# Altium schematic sheet Pixel1.0_1.SchDoc: Pixel1.0
size 409 x 282 mm; Date: 5/11/2016 6:59:08 PM; SheetNumber: 2
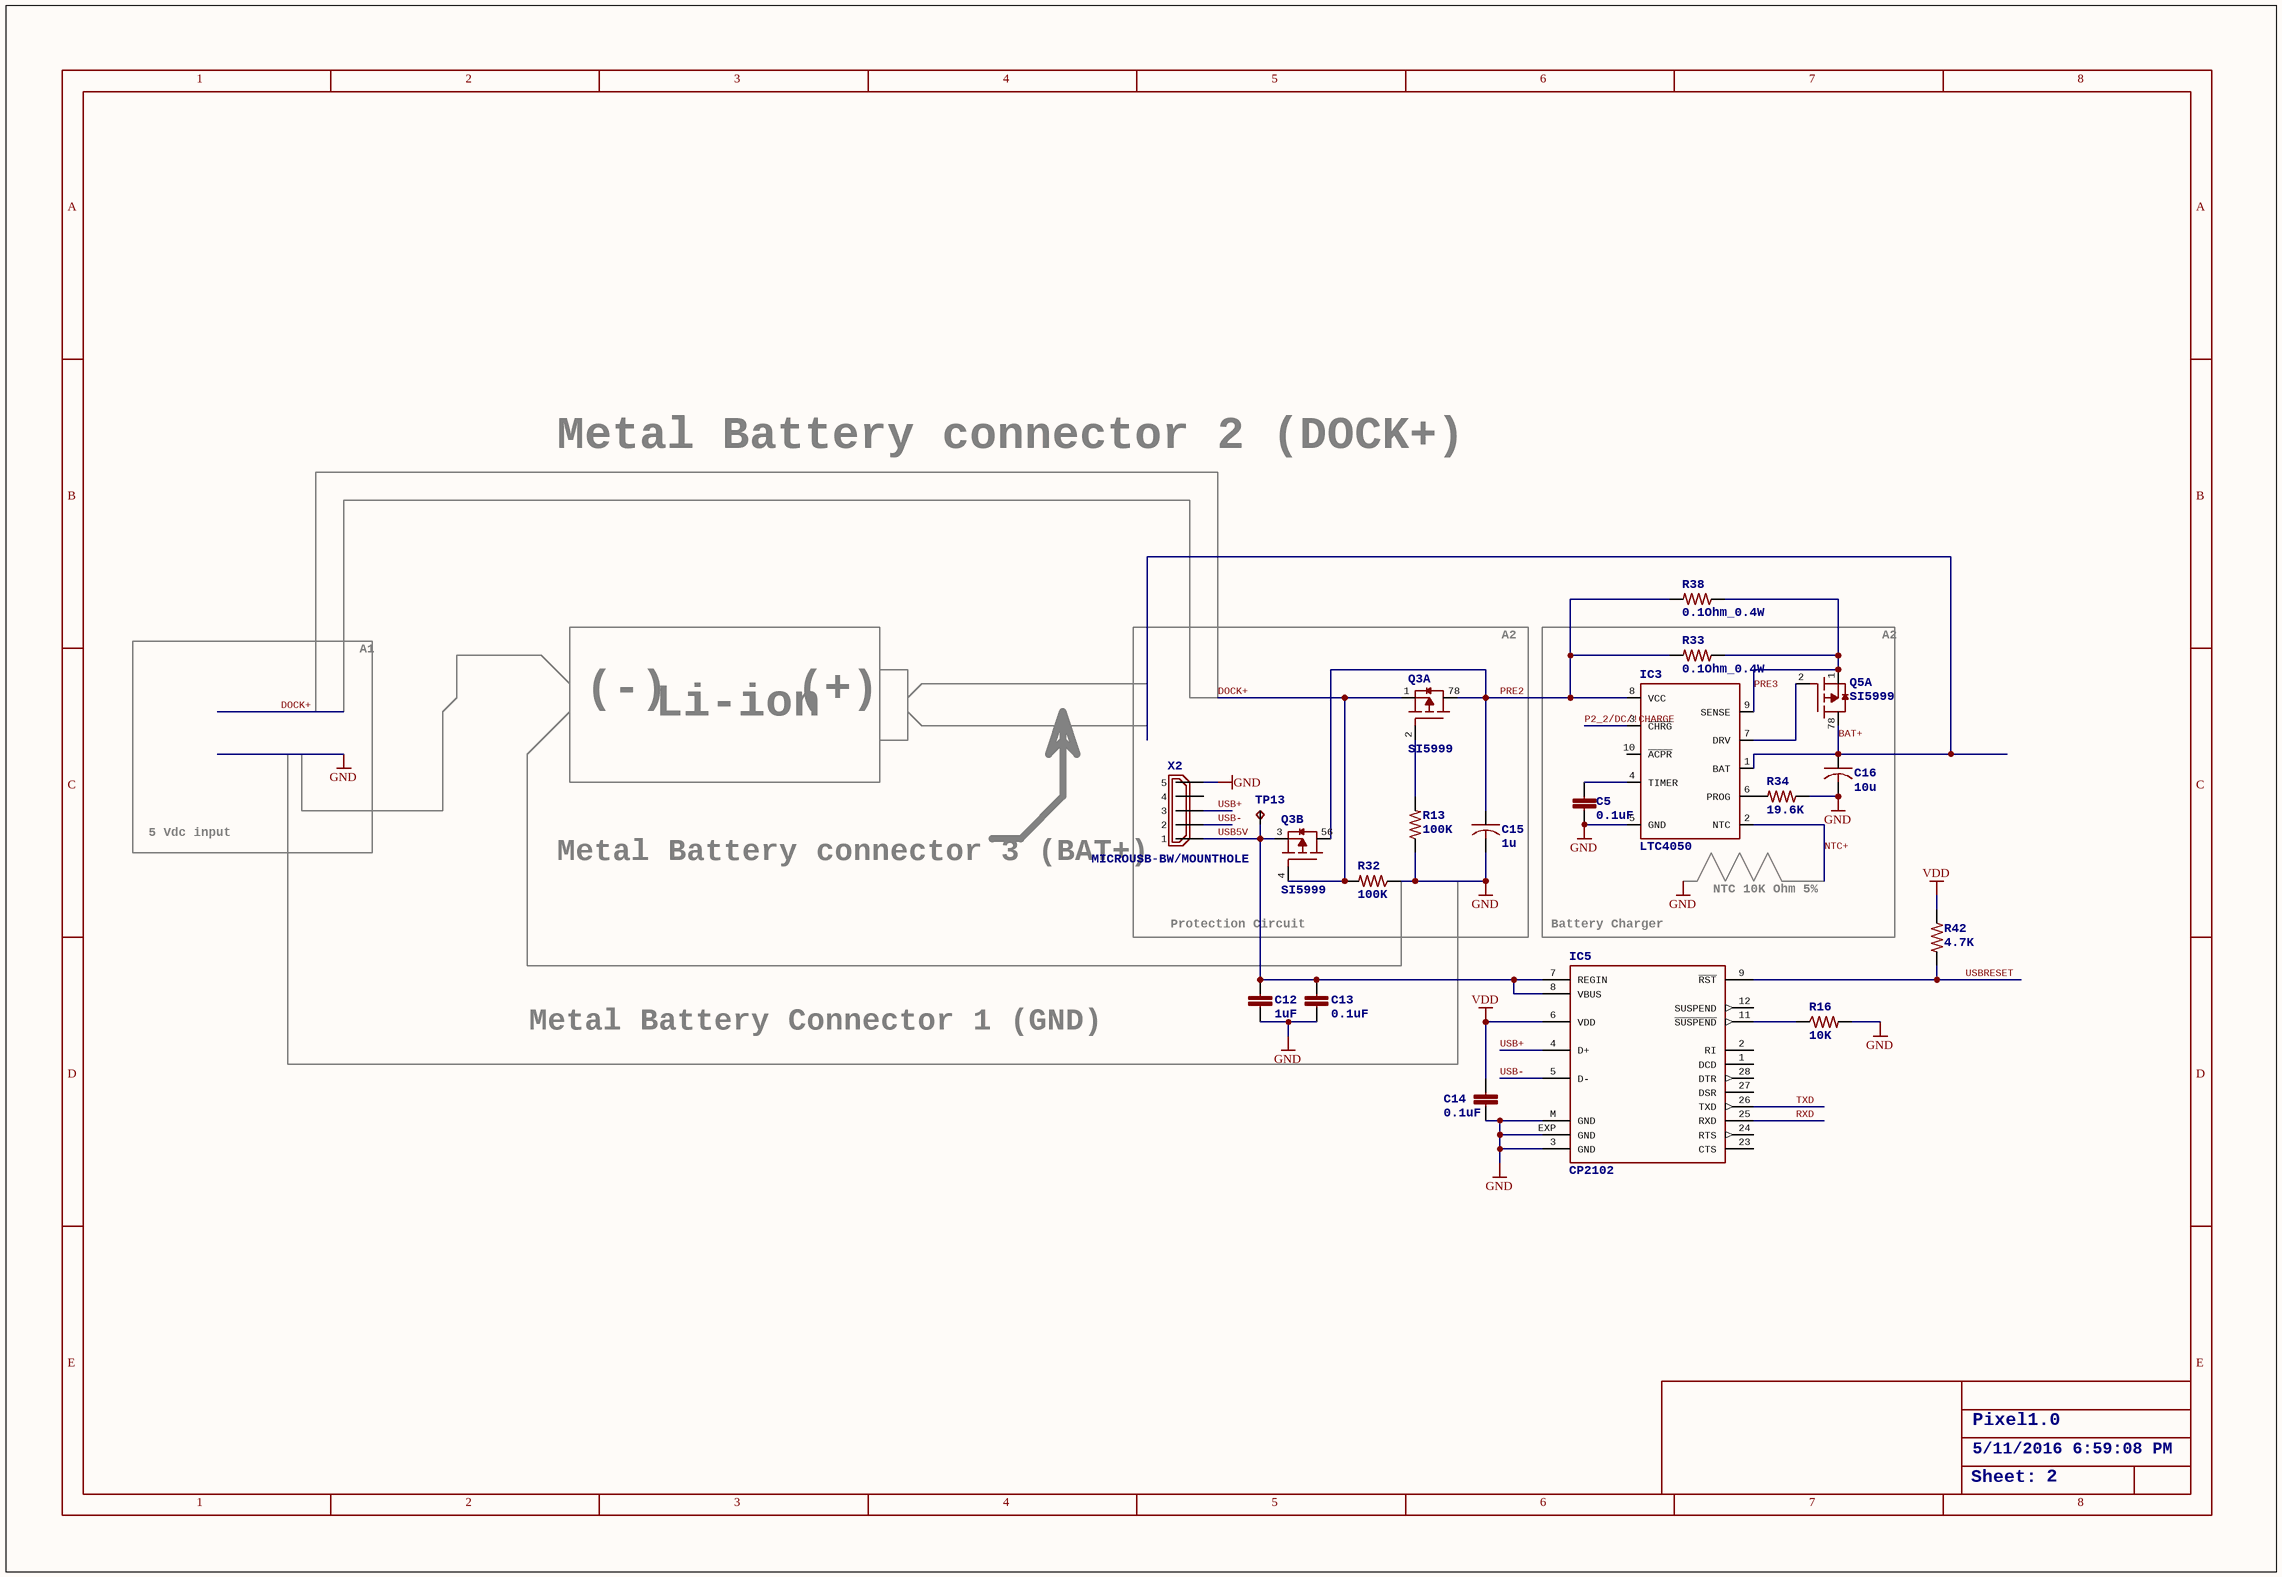
[diagram p0: Pixel1.0_1.SchDoc]

## Parts
C5  0.1uF  [C0201]
C12  1uF  [C0201]
C13  0.1uF  [C0201]
C14  0.1uF  [C0201]
C15  1u  [C0201]
C16  10u  [C0402]
IC3  LTC4050  [MSOP10]
IC5  CP2102  [MLP28]
Q3  SI5999  [1206-8CHIP-FET]  (parts A,B of 2)
Q5  SI5999  [1206-8CHIP-FET]  (part A of 2)
R13  100K  [R0201]
R16  10K  [R0201]
R32  100K  [R0201]
R33  0.1Ohm_0.4W  [R0603]
R34  19.6K  [R0201]
R38  0.1Ohm_0.4W  [R0603]
R42  4.7K  [R0201]
TP13  TPTP06R  [TP06R]  (value not drawn)
X2  MICROUSB-BW/MOUNTHOLE  [MICRO_USB_B]

## Nets
GND: C5.2 C12.2 C13.2 C14.2 C15.2 C16.2 IC3.5(GND) IC5.3(GND) IC5.EXP(GND) IC5.M(GND) R13.1 R16.2 R32.1 R34.1 X2.P$5(5)
VDD: C14.1 IC5.6(VDD) R42.1
BAT+: C16.1 IC3.1(BAT) Q5.78(D1)
DOCK+: Q3.1(S1) Q3.4(G2) R32.2
NTC+: IC3.2(NTC)
P2_2/DC/!CHARGE: IC3.3(~{CHRG})
PRE2: C15.1 IC3.8(VCC) Q3.56(D2) Q3.78(D1) R33.2 R38.2
PRE3: IC3.9(SENSE) Q5.1(S1) R33.1 R38.1
RXD: IC5.25(RXD)
TXD: IC5.26(TXD)
USB5V: C12.1 C13.1 IC5.7(REGIN) IC5.8(VBUS) Q3.3(S2) TP13.TP X2.P$1(1)
USB+: IC5.4(D+) X2.P$3(3)
USB-: IC5.5(D-) X2.P$2(2)
USBRESET: IC5.9(~{RST}) R42.2
NetC5_1: C5.1 IC3.4(TIMER)
NetIC3_6: IC3.6(PROG) R34.2
NetIC3_7: IC3.7(DRV) Q5.2(G1)
NetIC5_11: IC5.11(~{SUSPEND}) R16.1
NetQ3_2: Q3.2(G1) R13.2

Not connected (* = marked no-connect by the designer): IC3 10(~{ACPR}); IC5 1(DCD) 2(RI) 12(SUSPEND) 23(CTS) 24(RTS) 27(DSR) 28(DTR); X2 P$4(4)

## Notes on the sheet
- Metal Battery connector 2 (DOCK+)
- A1
- A2
- (-)
- Li-ion
- (+)
- 5 Vdc input
- Metal Battery connector 3 (BAT+)
- NTC 10K Ohm 5%
- Protection Circuit
- (near IC5) Battery Charger
- Metal Battery Connector 1 (GND)
- Pixel1.0
- 5/11/2016 6:59:08 PM
- Sheet:
- 2
- Labels drawn without touching a wire or pin: GND
- 1
- 3
- 4
- 5
- 6
- 7
- 8
- A
- B
- C
- D
- E

## Library data of the parts
C5 C12-C14 = C-EUC0201: CAPACITOR, European symbol
C15 = C-USC0201: CAPACITOR, American symbol
C16 = C-USC0402: CAPACITOR, American symbol
IC5 = CP210*: Single-Chip USB to UART Bridge   Source: www.silabs.com .. CP2101.pdf / cp2102.pdf; MPN: CP2102-GM; MF: FARNELL; OC_FARNELL: 9282130; OC_NEWARK: 30K5635
Q3 Q5 = SI5999: Dual N-Channel 30-V (D-S) MOSFET   Source: http://www.vishay.com/docs/71053/71053.pdf
R13 R16 R32 R34 R42 = R-US_R0201: RESISTOR, American symbol
R33 R38 = R-US_R0603: RESISTOR, American symbol
TP13 = TPTP06R: Test pad